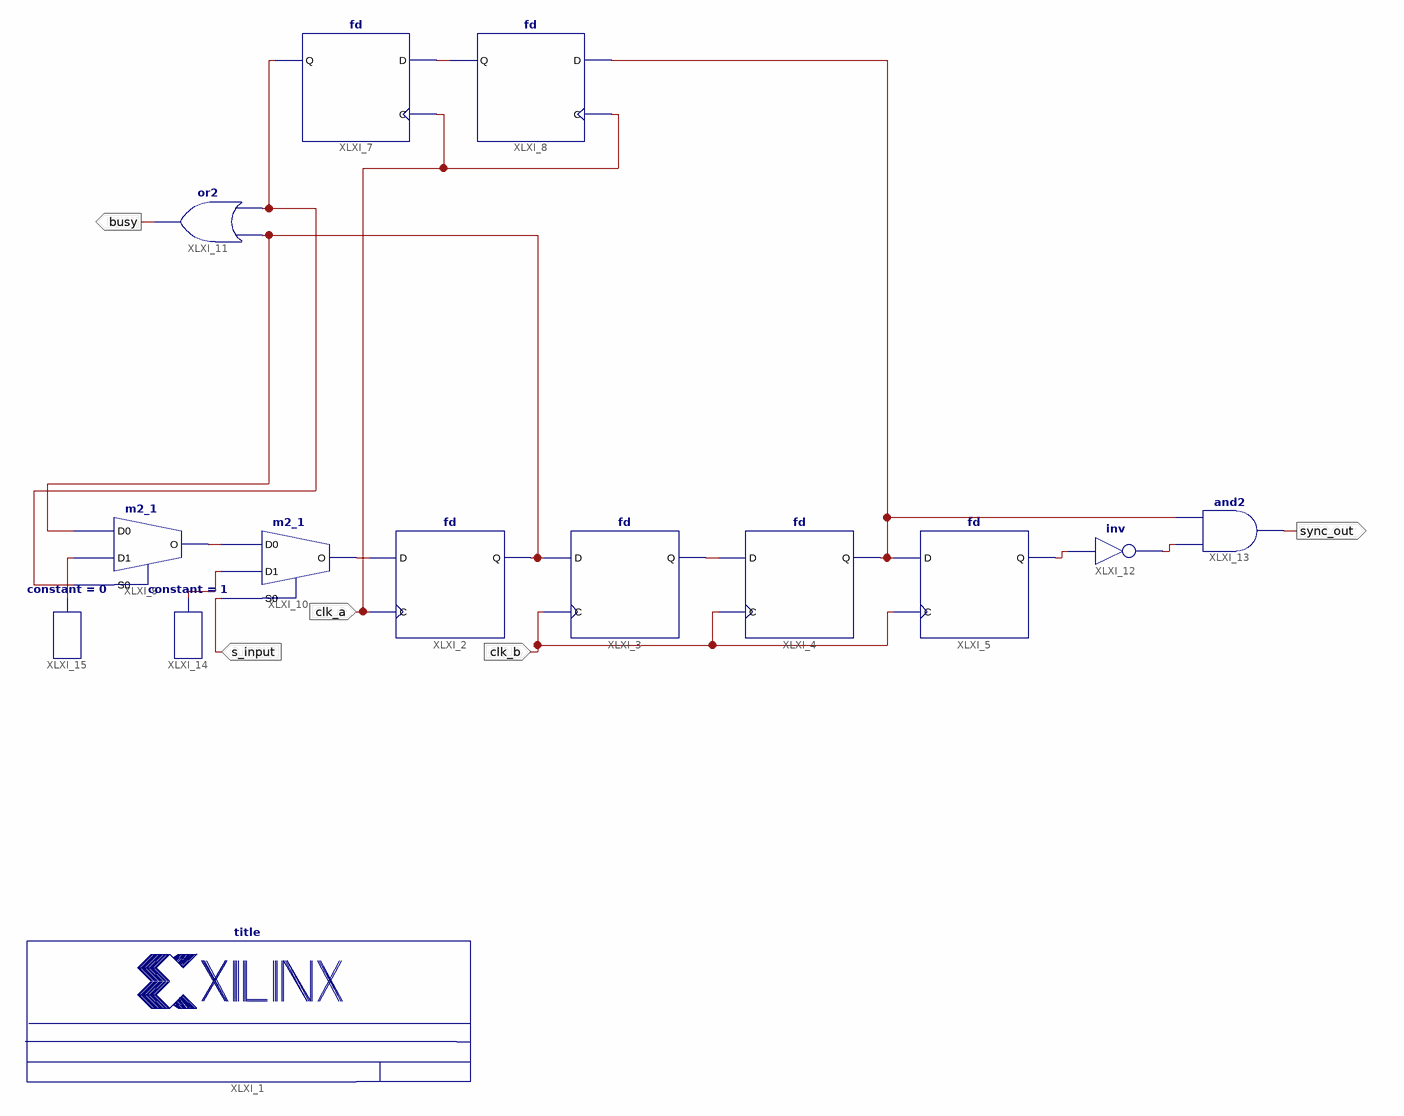
[diagram p0: schematic sheet 1]
// Xilinx ISE schematic HANDSHAKE_BASED_PULSE_SYNCHRONIZER.sch (spartan3e) as structural Verilog: 14 symbols, 5 ports
module HANDSHAKE_BASED_PULSE_SYNCHRONIZER (
  input  s_input,
  input  clk_a,
  input  clk_b,
  output sync_out,
  output busy
);

  wire XLXN_1, XLXN_3, XLXN_4, XLXN_5, XLXN_7, XLXN_8, XLXN_12, XLXN_14, XLXN_35, XLXN_38, XLXN_39;

  title #(.NameFieldText("Karthik Vippala")) XLXI_1 ();
  fd #(.INIT("0")) XLXI_2 (.C(clk_a), .D(XLXN_7), .Q(XLXN_35));
  fd XLXI_7 (.C(clk_a), .D(XLXN_1), .Q(XLXN_3));
  fd #(.INIT("0")) XLXI_8 (.C(clk_a), .D(XLXN_5), .Q(XLXN_1));
  m2_1 XLXI_9 (.D0(XLXN_35), .D1(XLXN_14), .S0(XLXN_3), .O(XLXN_8));
  m2_1 XLXI_10 (.D0(XLXN_8), .D1(XLXN_12), .S0(s_input), .O(XLXN_7));
  or XLXI_11 (busy, XLXN_35, XLXN_3);
  not XLXI_12 (XLXN_39, XLXN_38);
  and XLXI_13 (sync_out, XLXN_5, XLXN_39);
  constant #(.CValue("1")) XLXI_14 (.O(XLXN_12));
  constant #(.CValue("0")) XLXI_15 (.O(XLXN_14));
  fd XLXI_3 (.C(clk_b), .D(XLXN_35), .Q(XLXN_4));
  fd #(.INIT("1")) XLXI_4 (.C(clk_b), .D(XLXN_4), .Q(XLXN_5));
  fd XLXI_5 (.C(clk_b), .D(XLXN_5), .Q(XLXN_38));
endmodule
